# Altium project 28Pins_ProjectV1I1.PrjPcb
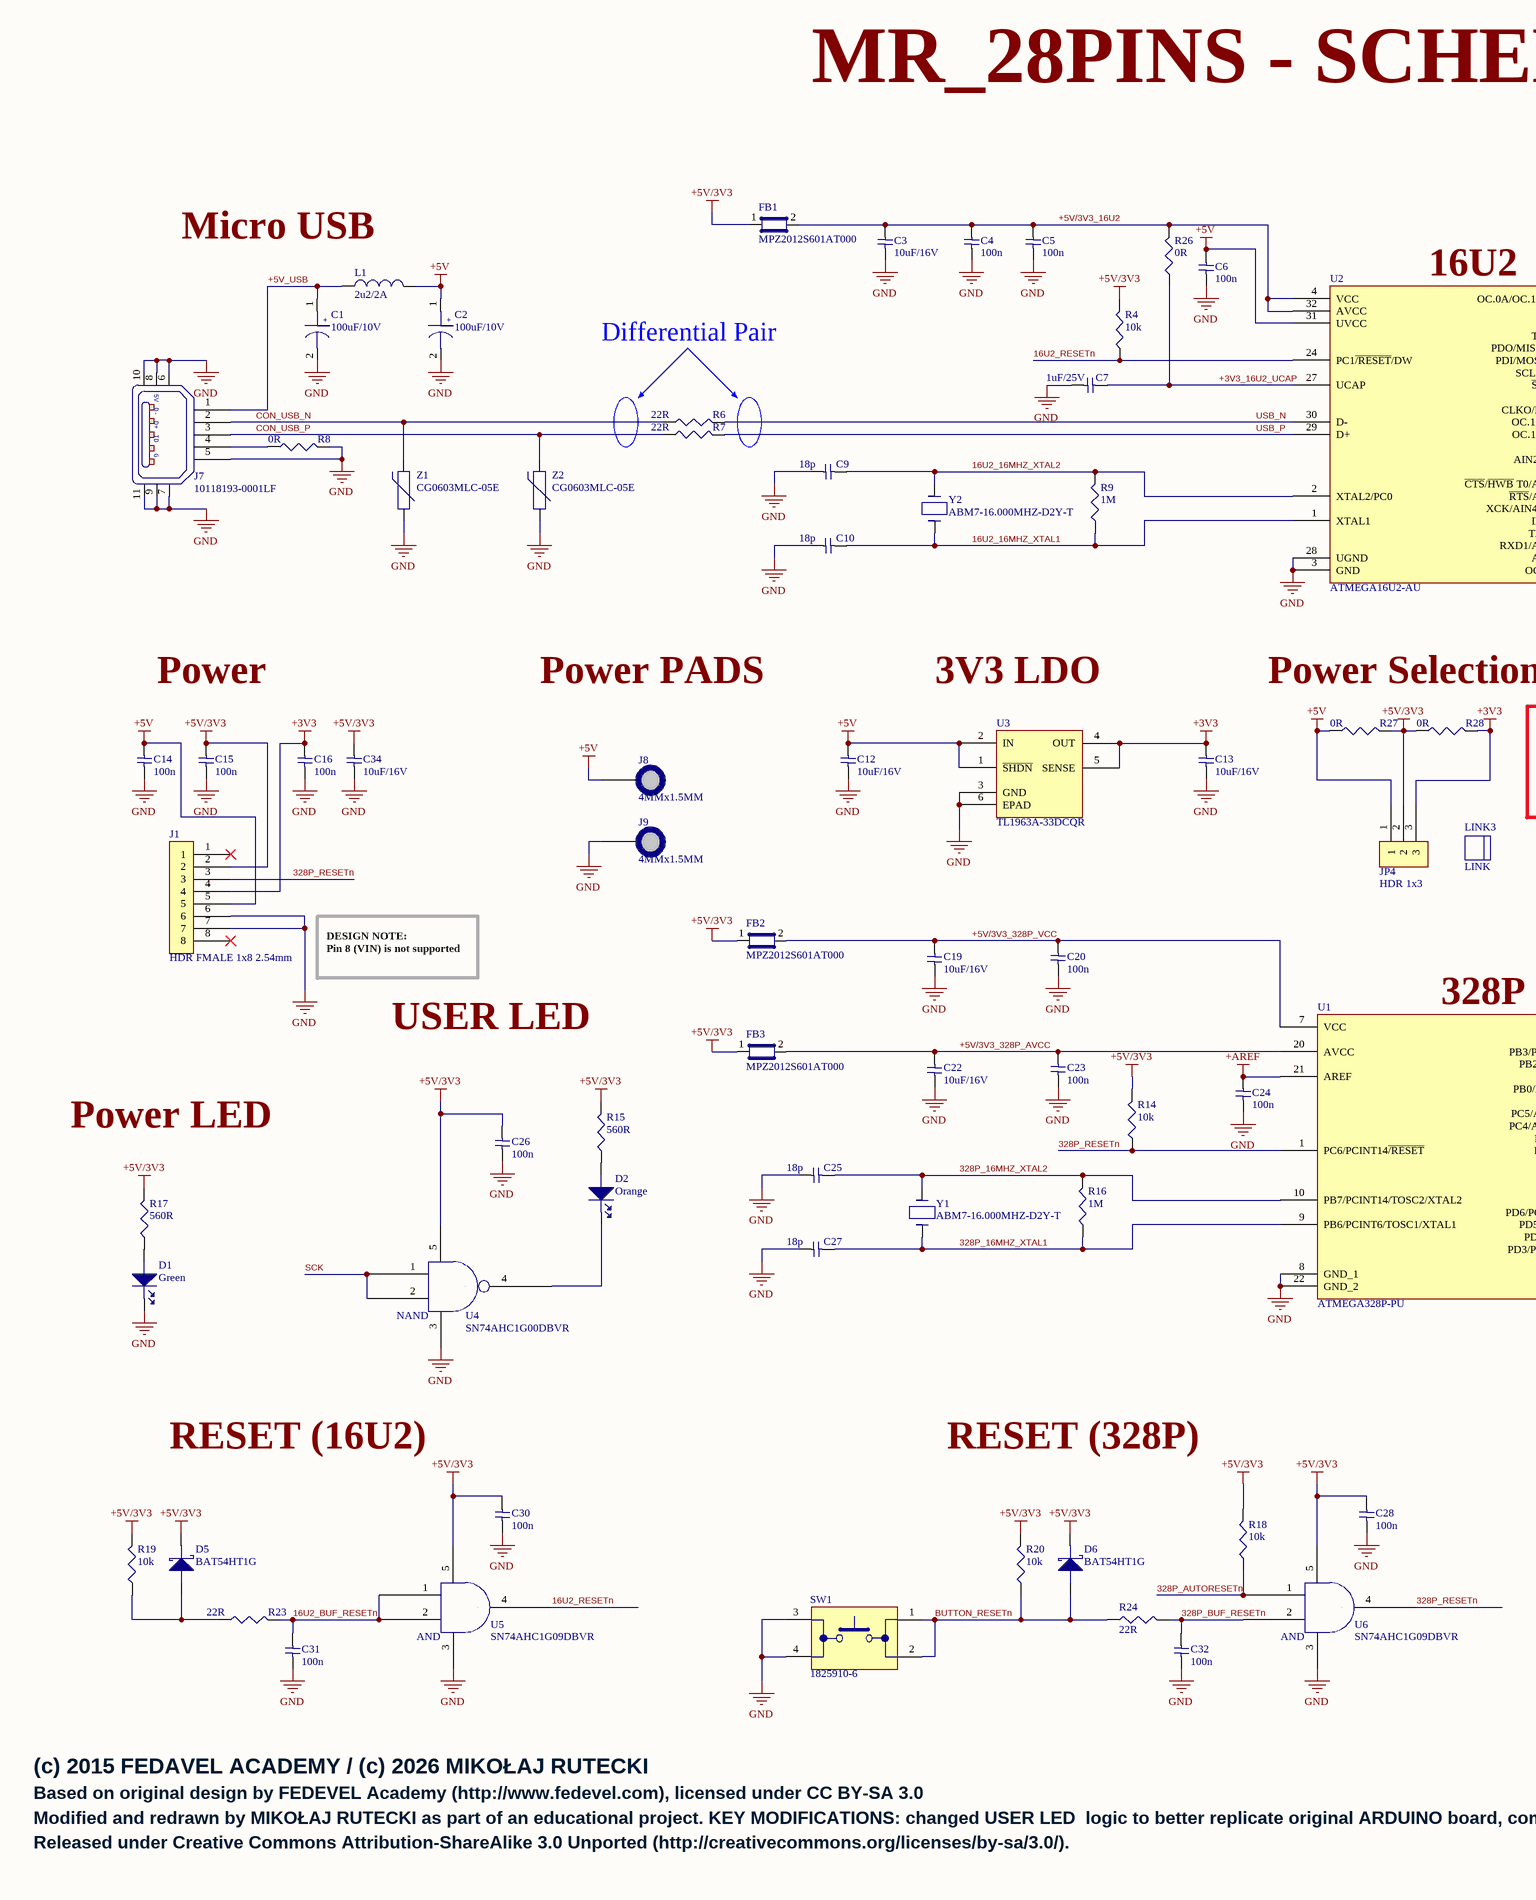
[diagram p0: 28pins_schematic.SchDoc, left]
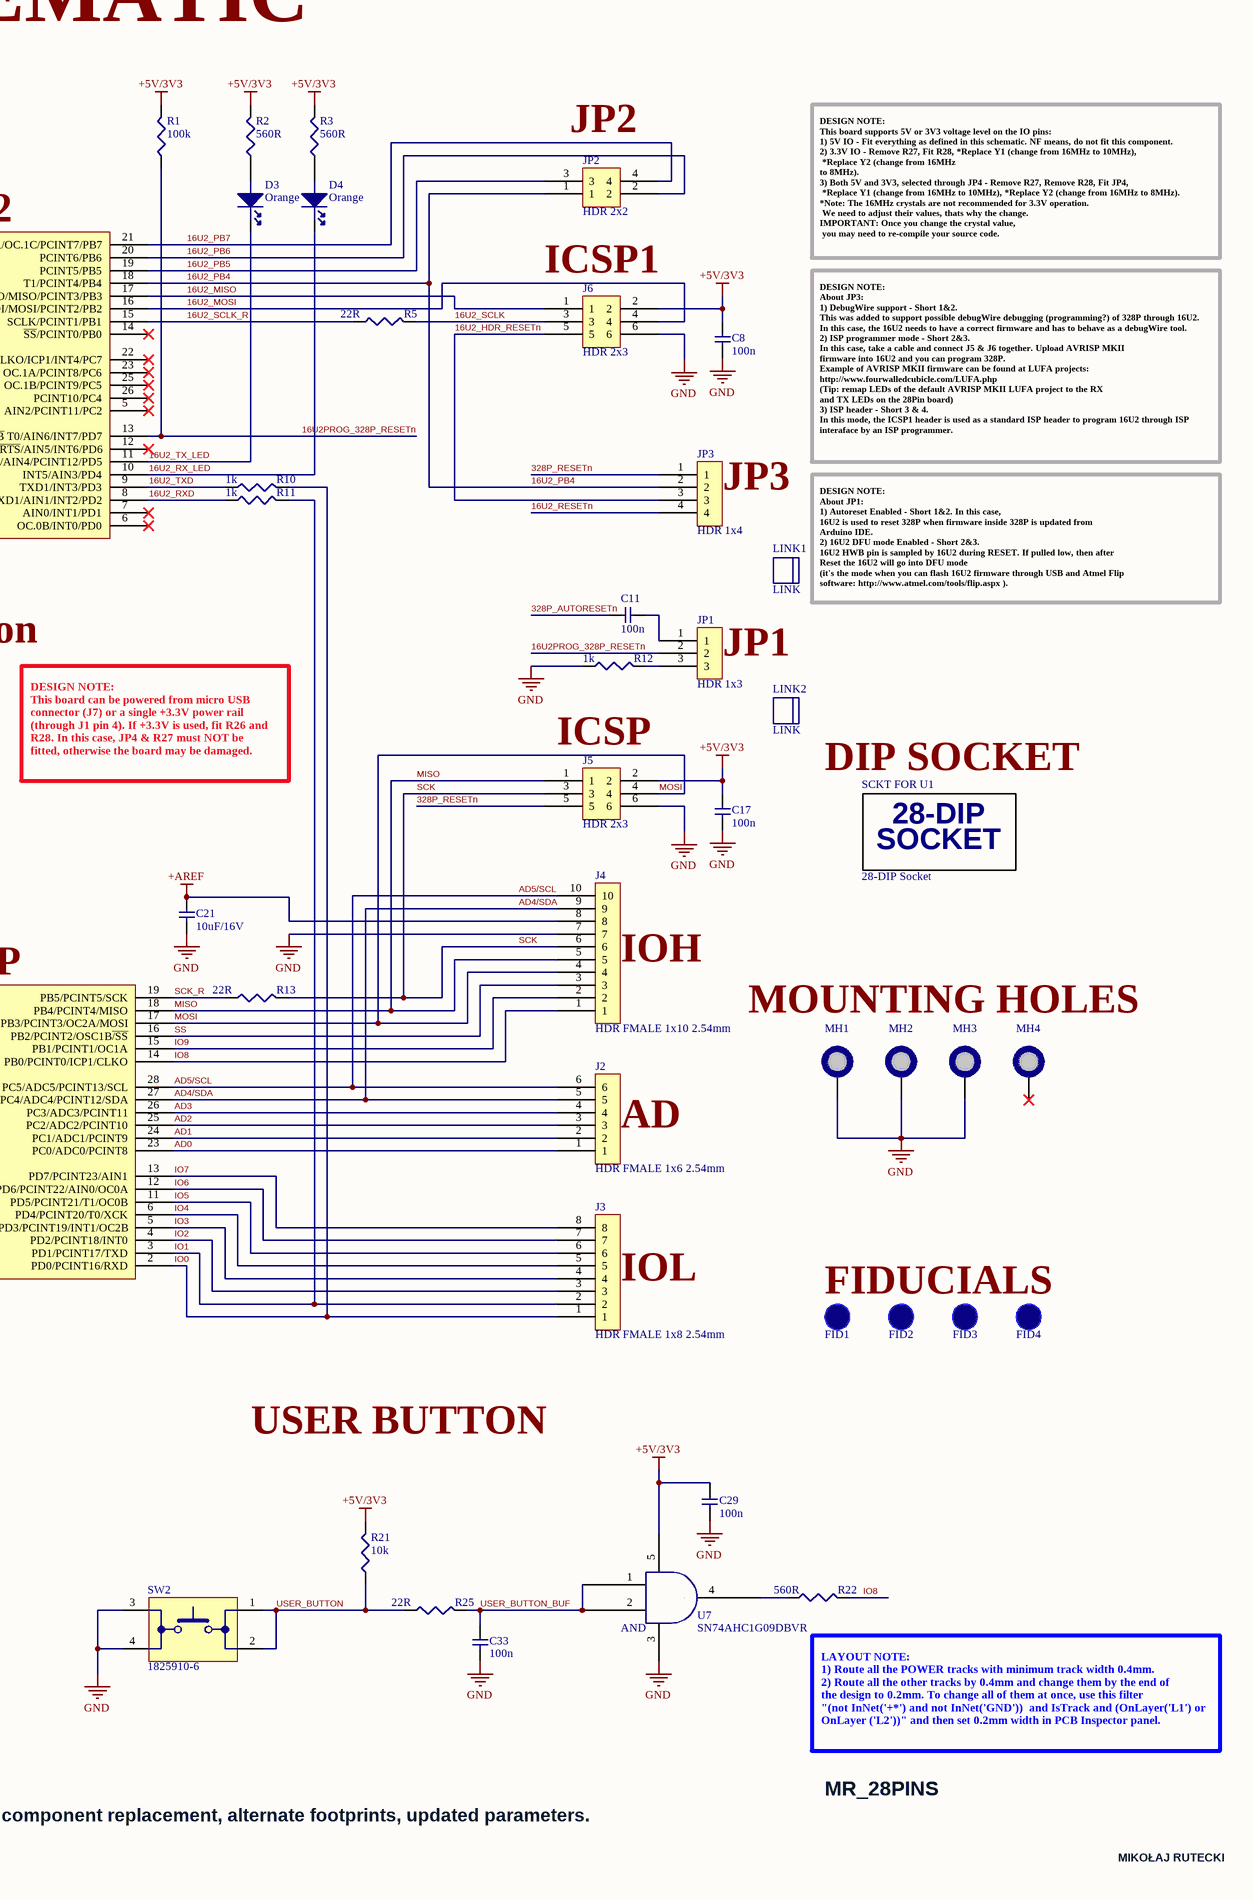
[diagram p1: 28pins_schematic.SchDoc, right]
NotFitted: NF
1 sheet, 109 parts. Net scope: global (net labels, ports and power ports of the same name join across sheets).
Board file: 28Pins_ProjectV1I1_PCB.PcbDoc

## Sheet 28pins_schematic.SchDoc
size A2

### Parts
C1  100uF/10V  [C_ALU_C_SIZE]
C2  100uF/10V  [C_ALU_C_SIZE]
C3  10uF/16V  [C0805]
C4  100n  [C0805]
C5  100n  [C0805]
C6  100n  [C0805]
C7  1uF/25V  [C0805]
C8  100n  [C0805]
C9  18p  [C0805]
C10  18p  [C0805]
C11  100n  [C0805]
C12  10uF/16V  [C0805]
C13  10uF/16V  [C0805]
C14  100n  [C0805]
C15  100n  [C0805]
C16  100n  [C0805]
C17  100n  [C0805]
C19  10uF/16V  [C0805]
C20  100n  [C0805]
C21  10uF/16V  [C0805]
C22  10uF/16V  [C0805]
C23  100n  [C0805]
C24  100n  [C0805]
C25  18p  [C0805]
C26  100n  [C0805]
C27  18p  [C0805]
C28  100n  [C0805]
C29  100n  [C0805]
C30  100n  [C0805]
C31  100n  [C0805]
C32  100n  [C0805]
C33  100n  [C0805]
C34  10uF/16V  [C0805]
D1  Green  [LED_0603]
D2  Orange  [LED_0603]
D3  Orange  [LED_0603]
D4  Orange  [LED_0603]
D5  BAT54HT1G  [SOD323]
D6  BAT54HT1G  [SOD323]
FB1  MPZ2012S601AT000  [C0805]
FB2  MPZ2012S601AT000  [C0805]
FB3  MPZ2012S601AT000  [C0805]
FID1  FID_1MM  [FID_40x120D]  (value not drawn)  (no BOM)
FID2  FID_1MM  [FID_40x120D]  (value not drawn)  (no BOM)
FID3  FID_1MM  [FID_40x120D]  (value not drawn)  (no BOM)
FID4  FID_1MM  [FID_40x120D]  (value not drawn)  (no BOM)
J1  HDR FMALE 1x8 2.54mm  [HDR_Female_1x8_2.54mm - duplicate]
J2  HDR FMALE 1x6 2.54mm  [HDR_Female_1x6_2.54mm]
J3  HDR FMALE 1x8 2.54mm  [HDR_Female_1x8_2.54mm - duplicate]
J4  HDR FMALE 1x10 2.54mm  [HDR_Female_1x10_2.54mm]
J5  HDR 2x3  [HDR_2x3_2.54MM]
J6  HDR 2x3  [HDR_2x3_2.54MM]
J7  10118193-0001LF  [10118193]
J8  4MMx1.5MM  [PAD_WITH_HOLE_4MMx1.5MM]  (no BOM)
J9  4MMx1.5MM  [PAD_WITH_HOLE_4MMx1.5MM]  (no BOM)
JP1  HDR 1x3  [HDR_1x3_2.54mm]
JP2  HDR 2x2  [HDR_2x2_2.54mm]
JP3  HDR 1x4  [HDR_1x4_2.54mm]
JP4  HDR 1x3  [HDR_1x3_2.54mm]
L1  2u2/2A  [C1210_IND]
LINK1  LINK  (mechanical)
LINK2  LINK  (mechanical)
LINK3  LINK  (mechanical)
MH1  MH_7.4MMC_3.2MMD  [MH_7.4MMD_3.2MMD]  (value not drawn)  (no BOM)
MH2  MH_7.4MMC_3.2MMD  [MH_7.4MMD_3.2MMD]  (value not drawn)  (no BOM)
MH3  MH_7.4MMC_3.2MMD  [MH_7.4MMD_3.2MMD]  (value not drawn)  (no BOM)
MH4  MH_7.4MMNC_3.2MMD  [MH_7.4MMD_3.2MMD_NON_COPPER_NPTH]  (value not drawn)  (no BOM)
R1  100k  [R0805]
R2  560R  [R0805]
R3  560R  [R0805]
R4  10k  [R0805]
R5  22R  [R0805]
R6  22R  [R0805]
R7  22R  [R0805]
R8  0R  [R0805]
R9  1M  [R0805]
R10  1k  [R0805]
R11  1k  [R0805]
R12  1k  [R0805]
R13  22R  [R0805]
R14  10k  [R0805]
R15  560R  [R0805]
R16  1M  [R0805]
R17  560R  [R0805]
R18  10k  [R0805]
R19  10k  [R0805]
R20  10k  [R0805]
R21  10k  [R0805]
R22  560R  [R0805]
R23  22R  [R0805]
R24  22R  [R0805]
R25  22R  [R0805]
R26  0R  [R0805]
R27  0R  [R0805]
R28  0R  [R0805]
SCKT_FOR_U1  28-DIP Socket  [28-DIP_7.62mm_SOCKET]
SW1  1825910-6  [1825910-6]
SW2  1825910-6  [1825910-6]
U1  ATMEGA328P-PU  [28_DIP_7.62mm]
U2  ATMEGA16U2-AU  [TQFP32]
U3  TL1963A-33DCQR  [DCQ(R-PDSO-G6)]
U4  SN74AHC1G00DBVR  [DBV_DOT_23_5]
U5  SN74AHC1G09DBVR  [DBV_DOT_23_5]
U6  SN74AHC1G09DBVR  [DBV_DOT_23_5]
U7  SN74AHC1G09DBVR  [DBV_DOT_23_5]
Y1  ABM7-16.000MHZ-D2Y-T  [ABM7_v1_1_BIG]
Y2  ABM7-16.000MHZ-D2Y-T  [ABM7_v1_1_BIG]
Z1  CG0603MLC-05E  [R0603]
Z2  CG0603MLC-05E  [R0603]

### Nets
+3V3: C13.2 C16.2 J1.4 JP4.3 R28.2 U3.4(OUT) U3.5(SENSE)
+5V: C2.1 C6.2 C12.2 C14.2 J1.5 J8.1 JP4.1 L1.2 R27.1 U2.31(UVCC) U3.1(~{SHDN}) U3.2(IN)
+5V/3V3: C8.2 C15.2 C17.2 C26.2 C28.2 C29.2 C30.2 C34.2 D5.1(Cathode) D6.1(Cathode) FB1.1 FB2.1 FB3.1 J1.2 J5.2 J6.2 JP4.2 R1.2 R2.2 R3.2 R4.2 R14.2 R15.2 R17.2 R18.2 R19.2 R20.2 R21.2 R27.2 R28.1 U4.5 U5.5 U6.5 U7.5
+AREF: C21.2 C24.2 J4.8 U1.21(AREF)
GND: C1.2 C2.2 C3.1 C4.1 C5.1 C6.1 C7.1 C8.1 C9.2 C10.2 C12.1 C13.1 C14.1 C15.1 C16.1 C17.1 C19.2 C20.1 C21.1 C22.2 C23.1 C24.1 C25.2 C26.1 C27.2 C28.1 C29.1 C30.1 C31.1 C32.1 C33.1 C34.1 D1.1(Cathode) J1.6 J1.7 J4.7 J5.6 J6.6 J7.5 J7.6 J7.7 J7.8 J7.9 J7.10 J7.11 J9.1 MH1.1 MH2.1 MH3.1 R8.2 R12.1 SW1.3 SW1.4 SW2.3 SW2.4 U1.8(GND_1) U1.22(GND_2) U2.3(GND) U2.28(UGND) U3.3(GND) U3.6(EPAD) U4.3 U5.3 U6.3 U7.3 Z1.1 Z2.1
16U2_16MHZ_XTAL1: C10.1 R9.1 U2.1(XTAL1) Y2.1
16U2_16MHZ_XTAL2: C9.1 R9.2 U2.2(XTAL2/PC0) Y2.2
16U2_BUF_RESETn: C31.2 R23.2 U5.1 U5.2
16U2_HDR_RESETn: J6.5 JP3.3
16U2_MISO: J6.1 U2.17(PDO/MISO/PCINT3/PB3)
16U2_MOSI: J6.4 U2.16(PDI/MOSI/PCINT2/PB2)
16U2_PB4: JP2.1 JP3.2 U2.18(T1/PCINT4/PB4)
16U2_PB5: JP2.3 U2.19(PCINT5/PB5)
16U2_PB6: JP2.2 U2.20(PCINT6/PB6)
16U2_PB7: JP2.4 U2.21(OC.0A/OC.1C/PCINT7/PB7)
16U2_RESETn: JP3.4 R4.1 U2.24(PC1~{/RESET}/DW) U5.4
16U2_RX_LED: D4.1(Cathode) U2.10(INT5/AIN3/PD4)
16U2_RXD: R11.1 U2.8(RXD1/AIN1/INT2/PD2)
16U2_SCLK: J6.3 R5.2
16U2_SCLK_R: R5.1 U2.15(SCLK/PCINT1/PB1)
16U2_TX_LED: D3.1(Cathode) U2.11(XCK/AIN4/PCINT12/PD5)
16U2_TXD: R10.1 U2.9(TXD1/INT3/PD3)
16U2PROG_328P_RESETn: JP1.2 R1.1 U2.13(~{CTS}/~{HWB}_T0/AIN6/INT7/PD7)
328P_16MHZ_XTAL1: C27.1 R16.1 U1.9(PB6/PCINT6/TOSC1/XTAL1) Y1.1
328P_16MHZ_XTAL2: C25.1 R16.2 U1.10(PB7/PCINT14/TOSC2/XTAL2) Y1.2
328P_AUTORESETn: C11.1 R18.1 U6.1
328P_BUF_RESETn: C32.2 R24.2 U6.2
328P_RESETn: J1.3 J5.5 JP3.1 R14.1 U1.1(PC6/PCINT14~{/RESET}) U6.4
+3V3_16U2_UCAP: C7.2 R26.1 U2.27(UCAP)
+5V/3V3_16U2: C3.2 C4.2 C5.2 FB1.2 R26.2 U2.4(VCC) U2.32(AVCC)
+5V/3V3_328P_AVCC: C22.1 C23.2 FB3.2 U1.20(AVCC)
+5V/3V3_328P_VCC: C19.1 C20.2 FB2.2 U1.7(VCC)
+5V_USB: C1.1 J7.1 L1.1
AD0: J2.1 U1.23(PC0/ADC0/PCINT8)
AD1: J2.2 U1.24(PC1/ADC1/PCINT9)
AD2: J2.3 U1.25(PC2/ADC2/PCINT10)
AD3: J2.4 U1.26(PC3/ADC3/PCINT11)
AD4/SDA: J2.5 J4.9 U1.27(PC4/ADC4/PCINT12/SDA)
AD5/SCL: J2.6 J4.10 U1.28(PC5/ADC5/PCINT13/SCL)
BUTTON_RESETn: D6.2(Anode) R20.1 R24.1 SW1.1 SW1.2
CON_USB_N: J7.2 R6.1 Z1.2
CON_USB_P: J7.3 R7.1 Z2.2
IO0: J3.1 R10.2 U1.2(PD0/PCINT16/RXD)
IO1: J3.2 R11.2 U1.3(PD1/PCINT17/TXD)
IO2: J3.3 U1.4(PD2/PCINT18/INT0)
IO3: J3.4 U1.5(PD3/PCINT19/INT1/OC2B)
IO4: J3.5 U1.6(PD4/PCINT20/T0/XCK)
IO5: J3.6 U1.11(PD5/PCINT21/T1/OC0B)
IO6: J3.7 U1.12(PD6/PCINT22/AIN0/OC0A)
IO7: J3.8 U1.13(PD7/PCINT23/AIN1)
IO8: J4.1 R22.2 U1.14(PB0/PCINT0/ICP1/CLKO)
IO9: J4.2 U1.15(PB1/PCINT1/OC1A)
MISO: J4.5 J5.1 U1.18(PB4/PCINT4/MISO)
MOSI: J4.4 J5.4 U1.17(PB3/PCINT3/OC2A/MOSI)
SCK: J4.6 J5.3 R13.2 U4.1 U4.2
SCK_R: R13.1 U1.19(PB5/PCINT5/SCK)
SS: J4.3 U1.16(PB2/PCINT2/OSC1B~{/SS})
USB_N: R6.2 U2.30(D-)
USB_P: R7.2 U2.29(D+)
USER_BUTTON: R21.1 R25.1 SW2.1 SW2.2
USER_BUTTON_BUF: C33.2 R25.2 U7.1 U7.2
NetC11_2: C11.2 JP1.1
NetD1_2: D1.2(Anode) R17.1
NetD2_1: D2.1(Cathode) U4.4
NetD2_2: D2.2(Anode) R15.1
NetD3_2: D3.2(Anode) R2.1
NetD4_2: D4.2(Anode) R3.1
NetD5_2: D5.2(Anode) R19.1 R23.1
NetJ7_4: J7.4 R8.1
NetJP1_3: JP1.3 R12.2
NetR22_1: R22.1 U7.4

Not connected (* = marked no-connect by the designer): J1 1* 8*; MH4 1*; U2 5(AIN2/PCINT11/PC2)* 6(OC.0B/INT0/PD0)* 7(AIN0/INT1/PD1)* 12(~{RTS}/AIN5/INT6/PD6)* 14(~{SS}/PCINT0/PB0)* 22(CLKO/ICP1/INT4/PC7)* 23(OC.1A/PCINT8/PC6)* 25(OC.1B/PCINT9/PC5)* 26(PCINT10/PC4)*

### Notes on the sheet
- MR_28PINS - SCHEMATIC
- (near JP2) JP2
- (near L1) Micro USB
- (near U2) 16U2
- DESIGN NOTE:
  This board supports 5V or 3V3 voltage level on the IO pins:
  1) 5V IO - Fit everything as defined in this schematic. NF means, do not fit this component.
  2) 3.3V IO - Remove R27, Fit R28, *Replace Y1 (change from 16MHz to 10MHz),
  *Replace Y2 (change from 16MHz
  to 8MHz).
  3) Both 5V and 3V3, selected through JP4 - Remove R27, Remove R28, Fit JP4,
  *Replace Y1 (change from 16MHz to 10MHz), *Replace Y2 (change from 16MHz to 8MHz).
  *Note: The 16MHz crystals are not recommended for 3.3V operation.
  We need to adjust their values, thats why the change.
  IMPORTANT: Once you change the crystal value,
  you may need to re-compile your source code.
- Differential Pair
- (near J6) ICSP1
- DESIGN NOTE:
  About JP3:
  1) DebugWire support - Short 1&2.
  This was added to support possible debugWire debugging (programming?) of 328P through 16U2.
  In this case, the 16U2 needs to have a correct firmware and has to behave as a debugWire tool.
  2) ISP programmer mode - Short 2&3.
  In this case, take a cable and connect J5 & J6 together. Upload AVRISP MKII
  firmware into 16U2 and you can program 328P.
  Example of AVRISP MKII firmware can be found at LUFA projects:
  http://www.fourwalledcubicle.com/LUFA.php
  (Tip: remap LEDs of the default AVRISP MKII LUFA project to the RX
  and TX LEDs on the 28Pin board)
  3) ISP header - Short 3 & 4.
  In this mode, the ICSP1 header is used as a standard ISP header to program 16U2 through ISP
  interaface by an ISP programmer.
- (near JP3) JP3
- Power
- Power PADS
- 3V3 LDO
- Power Selection
- (near LINK1) DESIGN NOTE:
  About JP1:
  1) Autoreset Enabled - Short 1&2. In this case,
  16U2 is used to reset 328P when firmware inside 328P is updated from
  Arduino IDE.
  2) 16U2 DFU mode Enabled - Short 2&3.
  16U2 HWB pin is sampled by 16U2 during RESET. If pulled low, then after
  Reset the 16U2 will go into DFU mode
  (it's the mode when you can flash 16U2 firmware through USB and Atmel Flip
  software: http://www.atmel.com/tools/flip.aspx ).
- JP1
- DESIGN NOTE:
  This board can be powered from micro USB
  connector (J7) or a single +3.3V power rail
  (through J1 pin 4). If +3.3V is used, fit R26 and
  R28. In this case, JP4 & R27 must NOT be
  fitted, otherwise the board may be damaged.
- (near J5) ICSP
- DIP SOCKET
- DESIGN NOTE:
  Pin 8 (VIN) is not supported
- (near J4) IOH
- USER LED
- (near U1) 328P
- MOUNTING HOLES
- Power LED
- (near J2) AD
- (near J3) IOL
- FIDUCIALS
- RESET (16U2)
- RESET (328P)
- USER BUTTON
- Based on original design by FEDEVEL Academy (http://www.fedevel.com), licensed under CC BY-SA 3.0
- (c) 2015 FEDAVEL ACADEMY / (c) 2026 MIKOŁAJ RUTECKI
- (near R22) LAYOUT NOTE:
  1) Route all the POWER tracks with minimum track width 0.4mm.
  2) Route all the other tracks by 0.4mm and change them by the end of
  the design to 0.2mm. To change all of them at once, use this filter
  "(not InNet('+*') and not InNet('GND'))  and IsTrack and (OnLayer('L1') or
  OnLayer ('L2'))" and then set 0.2mm width in PCB Inspector panel.
- MR_28PINS
- Modified and redrawn by MIKOŁAJ RUTECKI as part of an educational project. KEY MODIFICATIONS: changed USER LED  logic to better replicate original ARDUINO board, component replacement, alternate footprints, updated parameters.
- Released under Creative Commons Attribution-ShareAlike 3.0 Unported (http://creativecommons.org/licenses/by-sa/3.0/).
- MIKOŁAJ RUTECKI
- (in symbol 4828-3004-CP) 28-DIP; SOCKET
- (in symbol 10118193-0001LF) 5V; D-; D+; ID; G
- (in symbol EEE-1AA101WR) +
- (in symbol SN74AHC1G00DBVR) NAND
- (in symbol SN74AHC1G09DBVR) AND

### Library data of the parts
C1 C2 = EEE-1AA101WR: CAP ALUM 100UF 20% 10V SMD
C3 C12 C13 C19 C21 C22 C34 = CGA4J1X5R1C106M125AC: CAP CER 10UF 16V X5R 0805
C4-C6 C8 C11 C14-C17 C20 C23 C24 C26 C28-C33 = C2012X7R1H104K085AA: CAP CER 0.1UF 50V X7R 0805
C7 = C2012X5R1E105K125AA: CAP CER 1UF 25V X5R 0805
C9 C10 C25 C27 = C0805C180J5GACTU: CAP CER 18PF 50V NP0 0805
D1 = LG L29K-G2J1-24-0-2-R18-Z: LED GREEN DIFFUSED 0603 SMD
D2-D4 = LO L29K-H2K1-24-0-2-R18-Z: LED ORANGE DIFFUSED 0603 SMD
D5 D6 = BAT54HT1GOSCT-ND: DIODE SCHOTTKY 30V 200MA SOD323
FB1-FB3 = MPZ2012S601AT000: FERRITE CHIP BEAD 600 OHM SMD
FID1-FID4 = FID_1MM: Fiducial 40mil Diameter, 120mil Mask
J1 J3 = M20-7820842: 8-WAY SIL VERT SOCKET L/FREE
J2 = M20-7820646: 6-WAY SIL VERT SOCKET L/FREE
J4 = M20-7821046: 10-WAY SIL VERT SOCKET L/FREE
J5 J6 = 87227-3: CONN HEADER VERT 6POS 2.54MM
J7 = 10118193-0001LF: CONN RCPT USB2.0 MICRO B SMD R/A
J8 J9 = PAD_WITH_HOLE_4MMx1.5MM: Pad with a hole 4mmx1.5mm
JP1 JP4 = 68000-103HLF: CONN HEADER VERT 3POS 2.54MM
JP2 = 5-146256-2: CONN HEADER VERT 4POS 2.54MM
JP3 = 68001-204HLF: CONN HEADER VERT 4POS 2.54MM
L1 = L1210R2R2MDWIT: FIXED IND 2.2UH 2A 80 MOHM SMD
LINK1-LINK3 = QPC02SXGN-RC: CONN JUMPER SHORTING .100" GOLD
MH1-MH3 = MH_7.4MMC_3.2MMD: Mounting Hole 7.4mm Diameter, 3.2mm Drill
MH4 = MH_7.4MMNC_3.2MMD: Hole 7.4mm Diameter (NON COPPER), 3.2mm Drill NPTH
R1 = RC0805JR-07100KL: RES 100K OHM 5% 1/8W 0805
R2 R3 R15 R17 R22 = RC0805FR-07560RL: RES 560 OHM 1% 1/8W 0805
R4 R14 R18-R21 = RC0805FR-0710KL: RES 10K OHM 1% 1/8W 0805
R5-R7 R13 R23-R25 = RT0805FRE0722RL: RES SMD 22 OHM 1% 1/8W 0805
R8 R26-R28 = RC0805JR-070RL: RES 0 OHM JUMPER 1/8W 0805
R9 R16 = RC0805FR-071ML: RES SMD 1M OHM 1% 1/8W 0805
R10-R12 = RC0805FR-071KL: RES 1K OHM 1% 1/8W 0805
SCKT_FOR_U1 = 4828-3004-CP: CONN IC DIP SOCKET 28POS TIN
SW1 SW2 = 1825910-6: SWITCH TACTILE SPST-NO 0.05A 24V
U1 = ATMEGA328P-PU: IC MCU 8BIT 32KB FLASH 28DIP
U2 = ATMEGA16U2-AU: IC MCU 8BIT 16KB FLASH 32TQFP
U3 = TL1963A-33DCQR: IC REG LIN 3.3V 1.5A SOT-223-6
U4 = SN74AHC1G00DBVR: IC GATE NAND 1CH 2-INP SOT23-5
U5-U7 = SN74AHC1G09DBVR: IC GATE AND 1CH 2-INP SOT23-5
Y1 Y2 = ABM7-16.000MHZ-D2Y-T: CRYSTAL 16.0000MHZ 18PF SMD
Z1 Z2 = CG0603MLC-05E: VARISTOR 0603